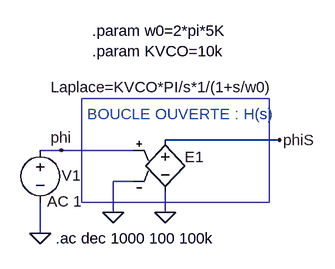
[diagram p0: schematic PLL_analogique_BO.asc]
PLL_analogique_BO.asc, the LTspice schematic file:
Version 4
SHEET 1 880 680
WIRE 336 112 160 112
WIRE 0 128 -32 128
WIRE 112 128 0 128
WIRE 112 176 80 176
WIRE 80 224 80 176
WIRE 160 224 160 192
WIRE -32 256 -32 208
FLAG 80 224 0
FLAG 160 224 0
FLAG 0 128 phi
FLAG 336 112 phiS
FLAG -32 256 0
SYMBOL E 160 96 R0
WINDOW 0 30 42 Left 0
WINDOW 3 -176 -65 Left 0
SYMATTR InstName E1
SYMATTR Value Laplace=KVCO*PI/s*1/(1+s/w0)
SYMBOL voltage -32 112 R0
WINDOW 123 11 95 Left 0
WINDOW 39 0 0 Left 0
WINDOW 0 33 55 Left 0
SYMATTR Value2 AC 1
SYMATTR InstName V1
SYMATTR Value ""
TEXT 48 -56 Left 0 !.param w0=2*pi*5K\n.param KVCO=10k
TEXT 40 72 Left 0 ;BOUCLE OUVERTE : H(s)
TEXT -8 264 Left 0 !.ac dec 1000 100 100k
RECTANGLE Normal 320 208 32 48

The netlist it stands for:
* PLL_analogique_BO.asc
E1 phiS 0 phi 0 Laplace=KVCO*PI/s*1/(1+s/w0)
V1 phi 0 AC 1
.param w0=2*pi*5K
.param KVCO=10k
* BOUCLE OUVERTE : H(s)
.ac dec 1000 100 100k
.backanno
.end